# Altium schematic sheet Sheet1.SchDoc
size A; SheetNumber: 1; SheetTotal: 1
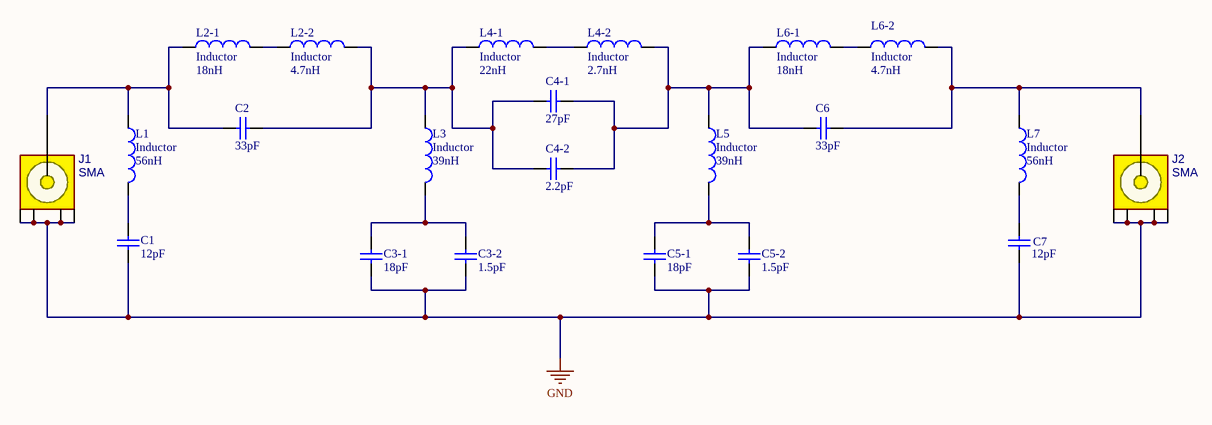
[diagram p0: Sheet1.SchDoc]

## Parts
C1  12pF  [CAP0805]
C2  33pF  [CAP0805]
C3-1  18pF  [CAP0805]
C3-2  1.5pF  [CAP0805]
C4-1  27pF  [CAP0805]
C4-2  2.2pF  [CAP0805]
C5-1  18pF  [CAP0805]
C5-2  1.5pF  [CAP0805]
C6  33pF  [CAP0805]
C7  12pF  [CAP0805]
J1  SMA  [SMA_EM]
J2  SMA  [SMA_EM]
L1  Inductor  value 56nH  [0402-A]
L2-1  Inductor  value 18nH  [INDC1608L]
L2-2  Inductor  value 4.7nH  [INDC1608L]
L3  Inductor  value 39nH  [0402-A]
L4-1  Inductor  value 22nH  [0402-A]
L4-2  Inductor  value 2.7nH  [0402-A]
L5  Inductor  value 39nH  [0402-A]
L6-1  Inductor  value 18nH  [0402-A]
L6-2  Inductor  value 4.7nH  [0402-A]
L7  Inductor  value 56nH  [0402-A]

## Nets
GND: C1.1 C3-1.1 C3-2.1 C5-1.1 C5-2.1 C7.1 J1.2(G1) J1.3(G2) J1.4(G3) J1.5(G4) J2.2(G1) J2.3(G2) J2.4(G3) J2.5(G4)
NetC1_2: C1.2 L1.2
NetC2_1: C2.1 C4-1.2 C4-2.2 L2-2.2 L3.1 L4-1.1
NetC2_2: C2.2 J1.1(SIG) L1.1 L2-1.1
NetC3-1_2: C3-1.2 C3-2.2 L3.2
NetC4-1_1: C4-1.1 C4-2.1 C6.2 L4-2.2 L5.1 L6-1.1
NetC5-1_2: C5-1.2 C5-2.2 L5.2
NetC6_1: C6.1 J2.1(SIG) L6-2.2 L7.1
NetC7_2: C7.2 L7.2
NetL2-1_2: L2-1.2 L2-2.1
NetL4-1_2: L4-1.2 L4-2.1
NetL6-1_2: L6-1.2 L6-2.1

## Library data of the parts
C1 C2 C3-1 C3-2 C4-1 C4-2 C5-1 C5-2 C6 C7 = CAP SMD PACKAGE: TOTAL CAPACITOR SMD PACK; Designer: Abbas Basereh; Desc.: CAP SMD TOTAL PACKAGES; VALUE: 100nF; Data: 2017-3-10
J1 J2 = CONN_RF_SMA_EM: CONN, RF, SMA, Edge mounting; MANF_P#: SMA-J-P-H-ST-EM1; MANF: Samtec; PARAM: 50Ohm, 20GHz; DESC: DESCRIPTION; DIST#: DIGIKEY; PARAM2: GOLD; ASSEMBLY: ASSEMBLY; PRICE: 4.3$; VALUE: SMA
L1 L2-1 L2-2 L3 L4-1 L4-2 L5 L6-1 L6-2 L7 = Inductor: Code_IEC: 1005; Published: 8-Jun-2000; LatestRevisionDate: 29-May-2009; LatestRevisionNote: IPC-7351 Footprint Added.; PackageReference: 0402-A; Publisher: Altium Limited; PackageDescription: Chip Inductor; Code_JEITA: 0402